# EAGLE design MessstationV2 (EAGLE 7.3.0)
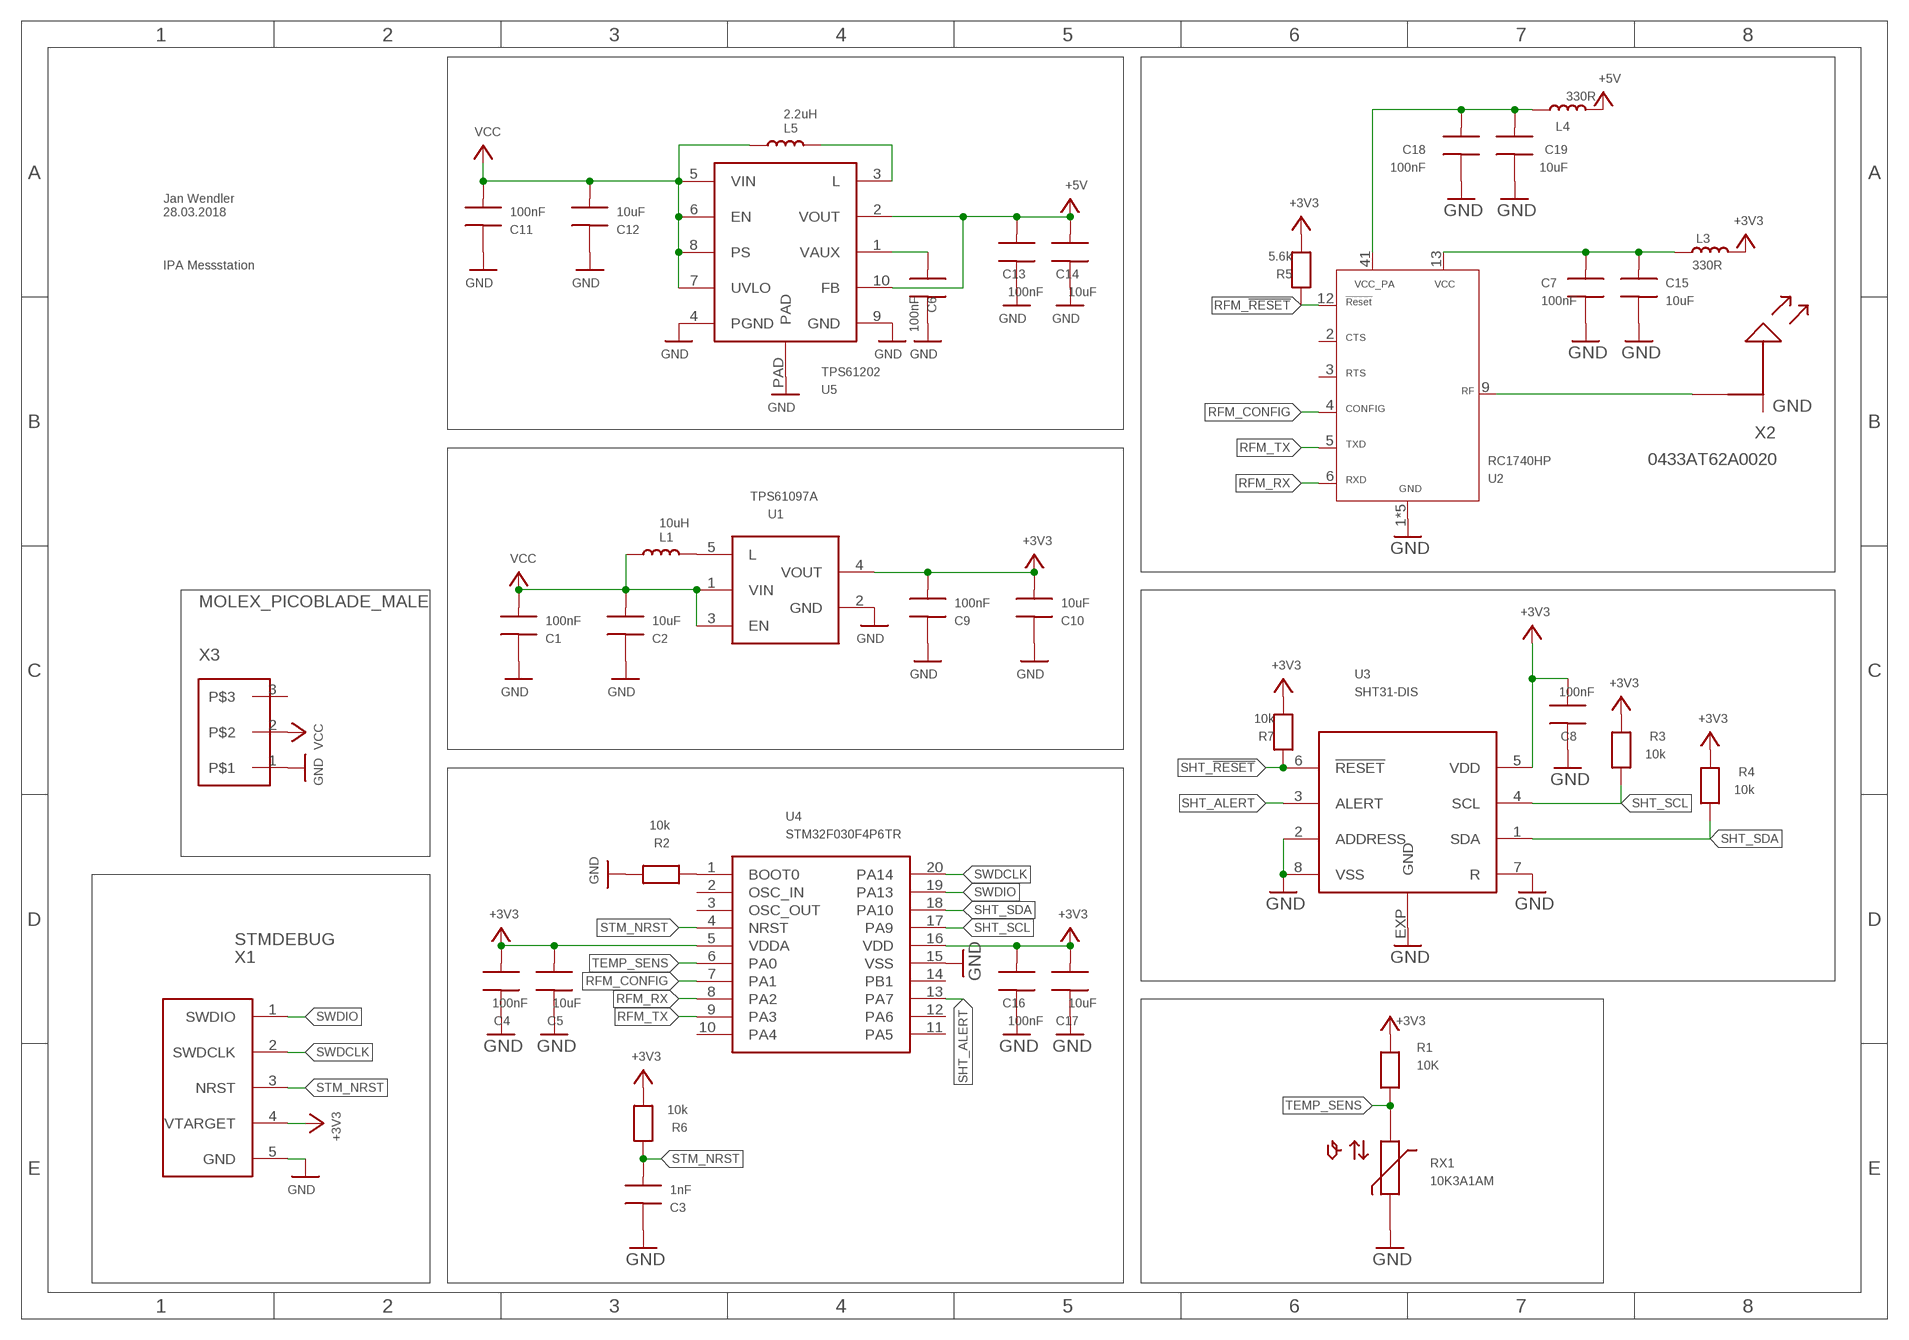
[diagram p0: schematic, sheet 1]

## Parts
C1  100nF  C0603  [0603]
C2  10uF  C0603  [0603]
C3  1nF  C0603  [0603]
C4  100nF  C0603  [0603]
C5  10uF  C0603  [0603]
C6  100nF  C0603  [0603]
C7  100nF  C0603  [0603]
C8  100nF  C0603  [0603]
C9  100nF  C0603  [0603]
C10  10uF  C0603  [0603]
C11  100nF  C0603  [0603]
C12  10uF  C0603  [0603]
C13  100nF  C0603  [0603]
C14  10uF  C0603  [0603]
C15  10uF  C0603  [0603]
C16  100nF  C0603  [0603]
C17  10uF  C0603  [0603]
C18  100nF  C0603  [0603]
C19  10uF  C0603  [0603]
L1  10uH  L3MM3.3MM  [L10]
L3  330R  L0603  [0603]
L4  330R  L0603  [0603]
L5  2.2uH  L3MM2.95MM  [L2_2]
R1  10K  R0603  [0603]
R2  10k  R0603  [0603]
R3  10k  R0603  [0603]
R4  10k  R0603  [0603]
R5  5.6k  R0603  [0603]
R6  10k  R0603  [0603]
R7  10k  R0603  [0603]
RX1  10K3A1AM  [TEMPSENS]
U1  TPS61097A  [SOT23-5L]
U2  RC1740HP  [RADIOCRAFTS_MODULE]
U3  SHT31-DIS  [DFN8-3X3]
U4  STM32F030F4P6TR  [TSSOP20]
U5  TPS61202  [VSON10]
X1  STMDEBUG  [STIFTLEISTE1X5]
X2  0433AT62A0020  [ANTENNE_CON]
X3  MOLEX_PICOBLADE_MALE  [MOLEX_PICOBLADE_MALE]

## Nets
+3V3: C4.1 C5.1 C8.1 C9.1 C10.1 C16.1 C17.1 L3.1 R1.2 R3.2 R4.2 R5.1 R6.1 R7.1 U1.4(VOUT) U3.5(VDD) U4.5(VDDA) U4.16(VDD) X1.4(VTARGET)
+5V: C13.1 C14.1 L4.1 U5.2(VOUT) U5.10(FB)
GND: C1.2 C2.2 C3.2 C4.2 C5.2 C6.2 C7.2 C8.2 C9.2 C10.2 C11.2 C12.2 C13.2 C14.2 C15.2 C16.2 C17.2 C18.2 C19.2 R2.2 RX1.P$3 U1.2(GND) U2.1(GND) U2.7(GND) U2.8(GND) U2.10(GND) U2.14(GND) U3.2(ADDRESS) U3.7(R) U3.8(VSS) U3.EXP(GND) U4.15(VSS) U5.4(PGND) U5.9(GND) U5.PAD X1.5(GND) X3.1
N$1: R2.1 U4.1(BOOT0)
N$2: L1.P$1 U1.5(L)
N$3: U2.9(RF) X2.P$1
N$4: C6.1 U5.1(VAUX)
N$6: C7.1 C15.1 L3.2 U2.13(VCC)
N$7: L5.P$1 U5.3(L)
N$8: C18.1 C19.1 L4.2 U2.41(VCC_PA)
RFM_!RESET!: R5.2 U2.12(!RESET!)
RFM_CONFIG: U2.4(CONFIG) U4.7(PA1)
RFM_RX: U2.6(RXD) U4.8(PA2)
RFM_TX: U2.5(TXD) U4.9(PA3)
SHT_!RESET!: R7.2 U3.6(!RESET!)
SHT_ALERT: U3.3(ALERT) U4.13(PA7)
SHT_SCL: R3.1 U3.4(SCL) U4.17(PA9)
SHT_SDA: R4.1 U3.1(SDA) U4.18(PA10)
STM_NRST: C3.1 R6.2 U4.4(NRST) X1.3(NRST)
SWDCLK: U4.20(PA14) X1.2(SWDCLK)
SWDIO: U4.19(PA13) X1.1(SWDIO)
TEMP_SENS: R1.1 RX1.P$4 U4.6(PA0)
VCC: C1.1 C2.1 C11.1 C12.1 L1.P$2 L5.P$2 U1.1(VIN) U1.3(EN) U5.5(VIN) U5.6(EN) U5.7(UVLO) U5.8(PS) X3.2
Unconnected: U2.2(CTS) U2.3(RTS) U4.2(OSC_IN) U4.3(OSC_OUT) U4.10(PA4) U4.11(PA5) U4.12(PA6) U4.14(PB1) X2.P$2(GND) X3.3

## Notes on the sheet
- Jan Wendler
  28.03.2018
- IPA Messstation

## Library data of the parts
C1-C19 = Messstation:C0603: Capacitor 0603
L1 L5 = Messstation:L3MM
L3 L4 = Messstation:L0603
R1-R7 = Messstation:R0603: Resistor 0603
RX1 = Messstation:10K3A1AM
U1 = Messstation:TPS61097A
U2 = Messstation:RC1740HP: RC1740HC Radiocrafts
U3 = Messstation:SHT31-DIS
U4 = Messstation:STM32F030F4P6TR
U5 = Messstation:TPS61202
X1 = Drohne:STMDEBUG: Debug Connector for STLinkV2 1x5 Stiftleiste
X2 = Messstation:0433AT62A0020
X3 = Messstation:MOLEX_PICOBLADE_MALE

## Board
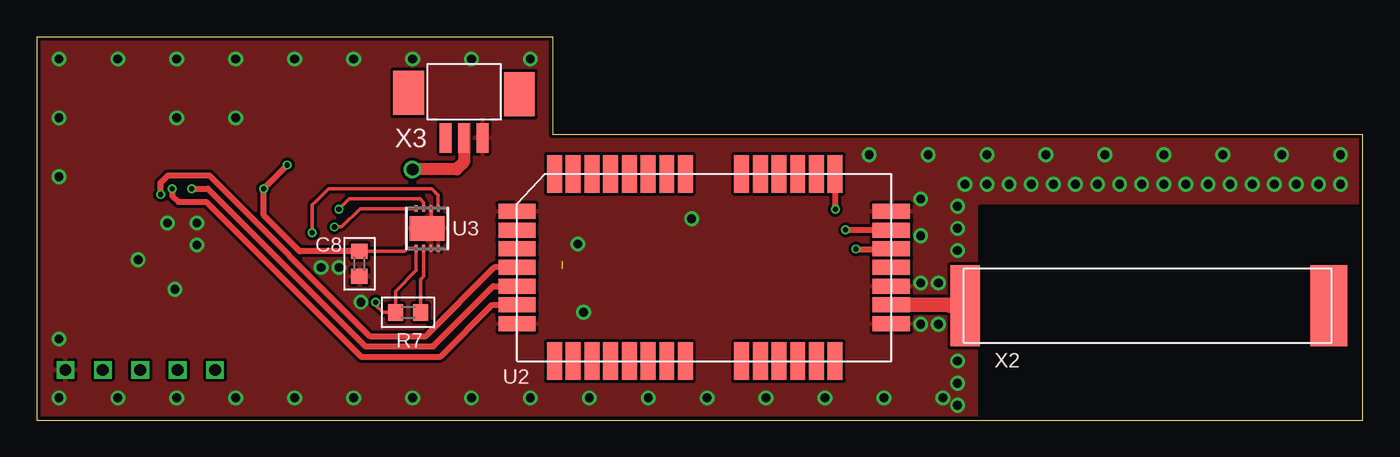
[diagram p1: board, top side]
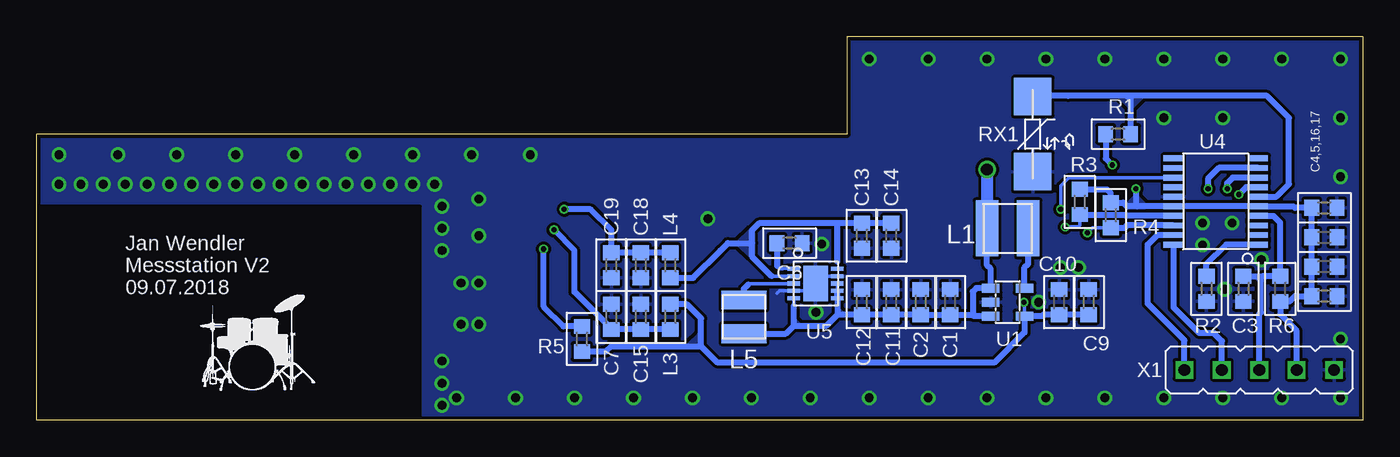
[diagram p2: board, bottom side, seen from below]

Size 90 x 26 mm. Coordinates in mm from the lower left corner, seen from the top.
Outline: 90,0 90,19.4 35,19.4 35,26 0,26 0,0 90,0
Copper layers (1*16): Top 0.018mm / dielectric 1.55mm / Bottom 0.018mm
Design rules "eC_2Layer_PClass6_BaseCopperO18_eCDefault *": minimum track width 0.15mm, minimum drill 0.35mm, track to track 0.15mm, track to pad 0.15mm, pad to pad 0.15mm, via to via 0.15mm, smd to smd 0mil, copper to edge 0.25mm, drill to drill 0.35mm, minimum pad ring 0.175mm, minimum via ring 0.125mm, stop-mask expansion 0mil, vias tented up to drill 0.6mm, thermal gap 0.2mm

### Footprints (pad centres in the part's own frame; a part is rotated, then mirrored left to right if it is on the bottom)
0603 = smd 1 x 1.1: 1 -0.85,0; 2 0.85,0
L10 = smd 1.524 x 3.81: P$1 -1.397,0; P$2 1.397,0
L2_2 = smd 1.27 x 3.048: P$1 -1.143,0; P$2 1.143,0
TEMPSENS = smd 2.54 x 2.54: P$3 -2.54,0; P$4 2.54,0
SOT23-5L = smd 0.6 x 1.2: 1 -0.95,-1.15; 2 0,-1.15; 3 0.95,-1.15; 4 0.95,1.15; 5 -0.95,1.15
RADIOCRAFTS_MODULE = smd 2.54 x 1.016: 1 -12.7,10.16; 2 -12.7,8.89; 3 -12.7,7.62; 4 -12.7,6.35; 5 -12.7,5.08; 6 -12.7,3.81; 7 -12.7,2.54; 8 12.7,2.54; 9 12.7,3.81; 10 12.7,5.08; 11 12.7,6.35; 12 12.7,7.62; 13 12.7,8.89; 14 12.7,10.16 | smd 1.016 x 2.54: 15 -10.16,0; 16 -8.89,0; 17 -7.62,0; 18 -6.35,0; 19 -5.08,0; 20 -3.81,0; 21 -2.54,0; 22 -1.27,0; 23 -1.27,12.7; 24 -2.54,12.7; 25 -3.81,12.7; 26 -5.08,12.7; 27 -6.35,12.7; 28 -7.62,12.7; 29 -8.89,12.7; 30 -10.16,12.7; 31 2.54,12.7; 32 2.54,0; 33 3.81,12.7; 34 3.81,0; 35 5.08,12.7; 36 5.08,0; 37 6.35,12.7; 38 6.35,0; 39 7.62,12.7; 40 7.62,0; 41 8.89,12.7; 42 8.89,0
DFN8-3X3 = smd 0.25 x 0.45: 1 -0.75,-1.35; 2 -0.25,-1.35; 3 0.25,-1.35; 4 0.75,-1.35; 5 0.75,1.35; 6 0.25,1.35; 7 -0.25,1.35; 8 -0.75,1.35 | smd 2.38 x 1.65: EXP 0,0
TSSOP20 = smd 0.4 x 1.35: 1 0,0; 2 0.65,0; 3 1.3,0; 4 1.95,0; 5 2.6,0; 6 3.25,0; 7 3.9,0; 8 4.55,0; 9 5.2,0; 10 5.85,0; 11 5.85,5.75; 12 5.2,5.75; 13 4.55,5.75; 14 3.9,5.75; 15 3.25,5.75; 16 2.6,5.75; 17 1.95,5.75; 18 1.3,5.75; 19 0.65,5.75; 20 0,5.75
VSON10 = smd 0.28 x 0.85: 1 0,0; 2 0.5,0; 3 1,0; 4 1.5,0; 5 2,0; 6 2,2.95; 7 1.5,2.95; 8 1,2.95; 9 0.5,2.95; 10 0,2.95 | smd 2.4 x 1.65: PAD 1,1.475
STIFTLEISTE1X5 = drill 0.8 square: 1 0,0; 2 2.54,0; 3 5.08,0; 4 7.62,0; 5 10.16,0
ANTENNE_CON = smd 2 x 5.5: P$1 0,0 | smd 2.5 x 5.5: P$2 24.7,0
MOLEX_PICOBLADE_MALE = smd 0.8 x 2: 1 -1.25,1.25; 2 0,1.25; 3 1.25,1.25 | smd 2.1 x 3: P$4 -3.75,-1.7; P$5 3.75,-1.8

### Placement (x,y rotation side)
C1  28,8 90 bottom
C2  30,8 90 bottom
C3  8.1,8.9 270 bottom
C4  2.6,8.4 0 bottom
C5  2.6,10.4 0 bottom
C6  38.9,12 0 bottom
C7  51,7 90 bottom
C8  21.9,10.6 270 top
C9  18.6,8 90 bottom
C10  20.6,8 90 bottom
C11  32,8 90 bottom
C12  34,8 90 bottom
C13  34,12.5 270 bottom
C14  32,12.5 270 bottom
C15  49,7 90 bottom
C16  2.6,12.4 0 bottom
C17  2.6,14.4 0 bottom
C18  49,10.5 270 bottom
C19  51,10.5 270 bottom
L1  24.1,13 180 bottom
L3  47,7 270 bottom
L4  47,10.5 90 bottom
L5  42,7 270 bottom
R1  16.6,19.4 180 bottom
R2  10.6,8.9 270 bottom
R3  19.2,14.8 90 bottom
R4  17.1,13.9 90 bottom
R5  53,5.5 90 bottom
R6  5.6,8.9 90 bottom
R7  25.2,7.3 0 top
RX1  22.4,19.4 90 bottom
U1  24.1,8 270 bottom
U2  45.3,4 0 top
U3  26.5,13 180 top
U4  7.1,11.9 90 bottom
U5  38.61,10.26 270 bottom
X1  12.1,3.4 0 bottom
X2  63,7.75 0 top
X3  29,20.4 180 top

### Tracks (layer width: path | path; a pad name or v marks a point on that pad's centre or on a via)
+3V3  (via drill 0.35)
  Top 0.25: v23,8 23,7.8 23.5,7.3 R7.1 24.35,8.75 25.75,10.15 U3.5 25.15,11.65 24.95,11.45 C8.1
  Top 0.4: v17,17.3 v15.4,15.7 15.4,13.9 17.85,11.45 C8.1
  Bottom 0.25: U1.4 22.95,7.95 v23,8
  Bottom 0.4: X1.4 4.48,6.05 5.6,7.17 R6.1 4.95,8.05 4.6,8.4 C4.1 C5.1 C16.1 C17.1 4.6,14.4 4.7,14.5 U4.5 U4.16 15.3,14.5 | C9.1 C10.1 21.65,7.15 21.75,7.05 U1.4 22.95,5.95 25.01,3.89 43.79,3.89 | R5.1 51.35,4.65 51,5 | R3.2 17.35,15.65 17.1,15.4 R4.2 16.25,14.75 16,14.5 15.3,14.5 | R1.2 17.45,17.75 v17,17.3 | v15.4,15.7 15.4,14.6 15.3,14.5
  Bottom 0.406: 43.79,3.89 44.9,5 | 44.9,5 44.9,6.9 45.85,7.85 L3.1 | 51,5 44.9,5
  pour Bottom (no thermals): 45,5.1 45,5.8 45.7,5.1
  pour Bottom (no thermals): 14.8,14.5 15.4,15.1 16,14.5
+5V  (1 unrouted)
  Bottom 0.25: U5.2 40.12,9.76
  Bottom 0.4: C14.1 C13.1 35.66,13.35 | 35.66,13.35 40.99,13.35 41.45,12.89 | 35.66,10.76 35.66,13.35 | 40.12,9.76 41.45,11.09 | 43.6,11.5 43.1,12
  Bottom 0.406: L4.1 45.45,9.65 43.6,11.5 | 41.45,11.09 41.45,12 | 41.45,12 41.45,12.89 | 43.1,12 41.45,12
  cutout Bottom (rank 6): 35.66,12.89 35.21,13.35 36.08,13.35 36.08,13.31
  pour Bottom (no thermals): 41.47,11.11 42.35,12 41.47,12.89
GND  (via drill 0.6 pad 1)
  Top 0.25: U3.2 26.75,13.25 U3.EXP
  Bottom 0.25: 36.63,9.76 U5.9 | 37.63,8.76 U5.4 39.59,8.76 39.75,8.6
  Bottom 0.4: 36.63,9.76 U5.PAD 37.63,8.76
  other vias: 62.5,4 63,16 60,9.3 61.2,9.3 60,6.5 61.2,6.5 62.5,14.5 9.37,8.87 6.87,10.87 8.87,13.37 10.87,13.37 10.87,11.87 36.72,11.94 44.45,13.65 1.5,1.5 5.5,1.5 9.5,1.5 13.5,1.5 17.5,1.5 21.5,1.5 1.5,5.5 1.5,24.5 5.5,24.5 9.5,24.5 13.5,24.5 17.5,24.5 1.5,20.5 1.5,16.5 25.5,1.5 64.5,16 66,16 67.5,16 69,16 70.5,16 72,16 73.5,16 75,16 76.5,16 78,16 79.5,16 81,16 82.5,16 84,16 85.5,16 87,16 88.5,16 62.5,13 62.5,11.5 62.5,2.5 60,15 60,12.5 9.5,20.5 13.5,20.5 88.5,18 84.5,18 80.5,18 76.5,18 72.5,18 68.5,18 64.5,18 60.5,18 56.5,18 29.5,1.5 33.5,1.5 37.5,1.5 41.5,1.5 45.5,1.5 49.5,1.5 53.5,1.5 57.5,1.5 62.5,1 21.5,24.5 25.5,24.5 61.5,1.5 19.3,10.35 20.51,10.35 22,8 29.5,24.5 33.5,24.5 37.1,7.3
  pour Top (isolate 0.2, rank 6): 91.64,-4.27 -13.77,-4.27 -13.77,32.56 91.64,32.56
  pour Bottom (isolate 0.2, rank 6): -15.04,-4.77 -15.04,32.06 24.33,32.06 24.33,31.28 77.67,31.28 77.67,32.06 91.64,32.06 91.64,-4.77
  cutout Bottom (rank 6): 93.5,14.5 64,14.5 64,-4 93.5,-4
N$1
  Bottom 0.4: R2.1 10.6,10.57 9.27,11.9 U4.1
N$2
  Bottom 0.4: U1.5 22.95,10.35 22.7,10.6 L1.P$1
N$3
  Top 1: U2.9 62,7.81 62,7.75 X2.P$1
N$4
  Bottom 0.2: U5.1 39.36,10.26
  Bottom 0.25: 39.75,10.45 39.56,10.26 39.36,10.26
  Bottom 0.406: C6.1 39.75,10.45
N$5
  cutout Top: 64,-4 64,14.5 94,14.5 94,-4
N$6  (via drill 0.35)
  Top 0.4: v54.9,12.9 U2.13
  Bottom 0.4: C7.1 51,6.2 53.5,8.7 53.5,11.5 v54.9,12.9
  Bottom 0.406: L3.2 C15.1 C7.1
N$7
  Bottom 0.25: U5.3 41.64,9.26 41.7,9.2
  Bottom 0.4: L5.P$1 42,8.9 41.7,9.2
N$8  (via drill 0.35)
  Top 0.4: v54.2,14.3 U2.41
  Bottom 0.4: C19.1 51,12.9 52.4,14.3 v54.2,14.3
  Bottom 0.406: L4.2 C18.1 C19.1
RFM_!RESET!  (via drill 0.35)
  Top 0.4: v55.6,11.6 57.98,11.6 U2.12
  Bottom 0.4: R5.2 54.25,6.35 55.6,7.7 v55.6,11.6
RFM_CONFIG  (via drill 0.35)
  Top 0.4: v8.4,15.3 8.4,16.1 8.9,16.6 11.7,16.6 22.6,5.7 26.4,5.7 31.05,10.35 U2.4
  Bottom 0.4: U4.7 7.9,15.8 v8.4,15.3
RFM_RX  (via drill 0.35)
  Top 0.4: v9.2,15.7 9.2,15.2 9.6,14.8 11.5,14.8 22,4.3 27.4,4.3 30.91,7.81 U2.6
  Bottom 0.4: U4.8 8.82,16.45 9.2,16.07 v9.2,15.7
RFM_TX  (via drill 0.35)
  Top 0.4: v10.5,15.7 11.6,15.7 22.3,5 26.9,5 30.98,9.08 U2.5
  Bottom 0.4: U4.9 9.77,17.1 10.5,16.37 v10.5,15.7
SHT_!RESET!
  Top 0.25: R7.2 26.05,9.55 26.25,9.75 U3.6
SHT_ALERT  (via drill 0.35)
  Top 0.25: U3.3 26.25,14.75 26,15 21.2,15 v20.5,14.3
  Bottom 0.25: v20.5,14.3 20.5,15.9 19.95,16.45 U4.13
SHT_SCL  (via drill 0.35)
  Top 0.25: U3.4 21.95,14.35 20.7,13.1 v20.2,13.1
  Bottom 0.25: v20.2,13.1 19.3,13.1 19.2,13.2 R3.1
  Bottom 0.4: U4.17 16.05,13.85 16.1,13.9 19.15,13.9 R3.1
SHT_SDA  (via drill 0.35)
  Top 0.25: v18.7,12.7 18.7,14.6 18.95,14.85 19.3,15.2 19.8,15.7 26.8,15.7 27.25,15.25 U3.1
  Bottom 0.25: v18.7,12.7 18.35,13.05 R4.1
  Bottom 0.4: U4.18 16,13.2 16.15,13.05 R4.1
STM_NRST
  Bottom 0.4: X1.3 7.02,7.18 6.9,7.3 6.9,9.7 | U4.4 6.06,13.85 5.6,13.39 R6.2 6.85,9.75 6.9,9.7 | C3.1 6.95,9.75 6.9,9.7
  pour Bottom: 6.47,9.72 6.9,9.29 7.28,9.67 7.23,9.72
SWDCLK
  Bottom 0.4: X1.2 9.56,5.36 10.1,5.9 11.1,5.9 12.85,7.65 U4.20
SWDIO
  Bottom 0.4: X1.1 12.1,5.4 14.6,7.9 14.6,11.9 13.95,12.55 U4.19
TEMP_SENS
  Bottom 0.4: U4.6 5.85,15.15 5,16 5,20.5 6.5,22 16,22 | 16,22 20,22 | R1.1 15.75,21.75 16,22
  Bottom 0.406: 20,22 22.4,22 RX1.P$4
  pour Bottom: 15,22 16.5,22 15.75,21.25
VCC  (via drill 0.8 pad 0.9)
  Top 0.8: X3.2 29,17.5 28.5,17 v25.5,17
  Bottom 0.25: U5.7 U5.8 | 38.61,7.72 U5.5
  Bottom 0.4: U5.7 U5.6 35.66,7.13 | 35.66,7.13 36.39,6.4 38.61,6.4 | C2.1 C1.1 26.5,7.15 | 26.5,7.15 26.4,7.05 U1.3 | 26.5,7.15 26.47,7.18 26.47,8.71 26.23,8.95 U1.1 25.25,10.25 25.5,10.5 25.5,12.5 L1.P$2 | 35.66,7.13 35.64,7.15 C12.1 C2.1 | C2.1 C11.1 | 38.61,6.4 38.61,7.72 | L5.P$2 39.15,5.86 38.61,6.4
  Bottom 0.8: v25.5,17 25.5,12.5
  pour Bottom (no thermals): 38.61,6.73 38.61,6.4 38.28,6.4
  pour Bottom (no thermals): 35.66,7.48 35.66,7.15 35.33,7.15

### Text on the board
bPlace: C4,5,16,17 | Jan Wendler / Messstation V2 / 09.07.2018